# Altium schematic sheet Sheet1.SchDoc
size A
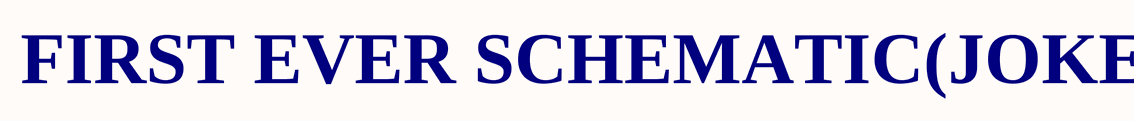
[diagram p0: Sheet1.SchDoc]

## Notes on the sheet
- FIRST EVER SCHEMATIC(JOKE!)